# EAGLE schematic hexgame-r1 (EAGLE 5.12)
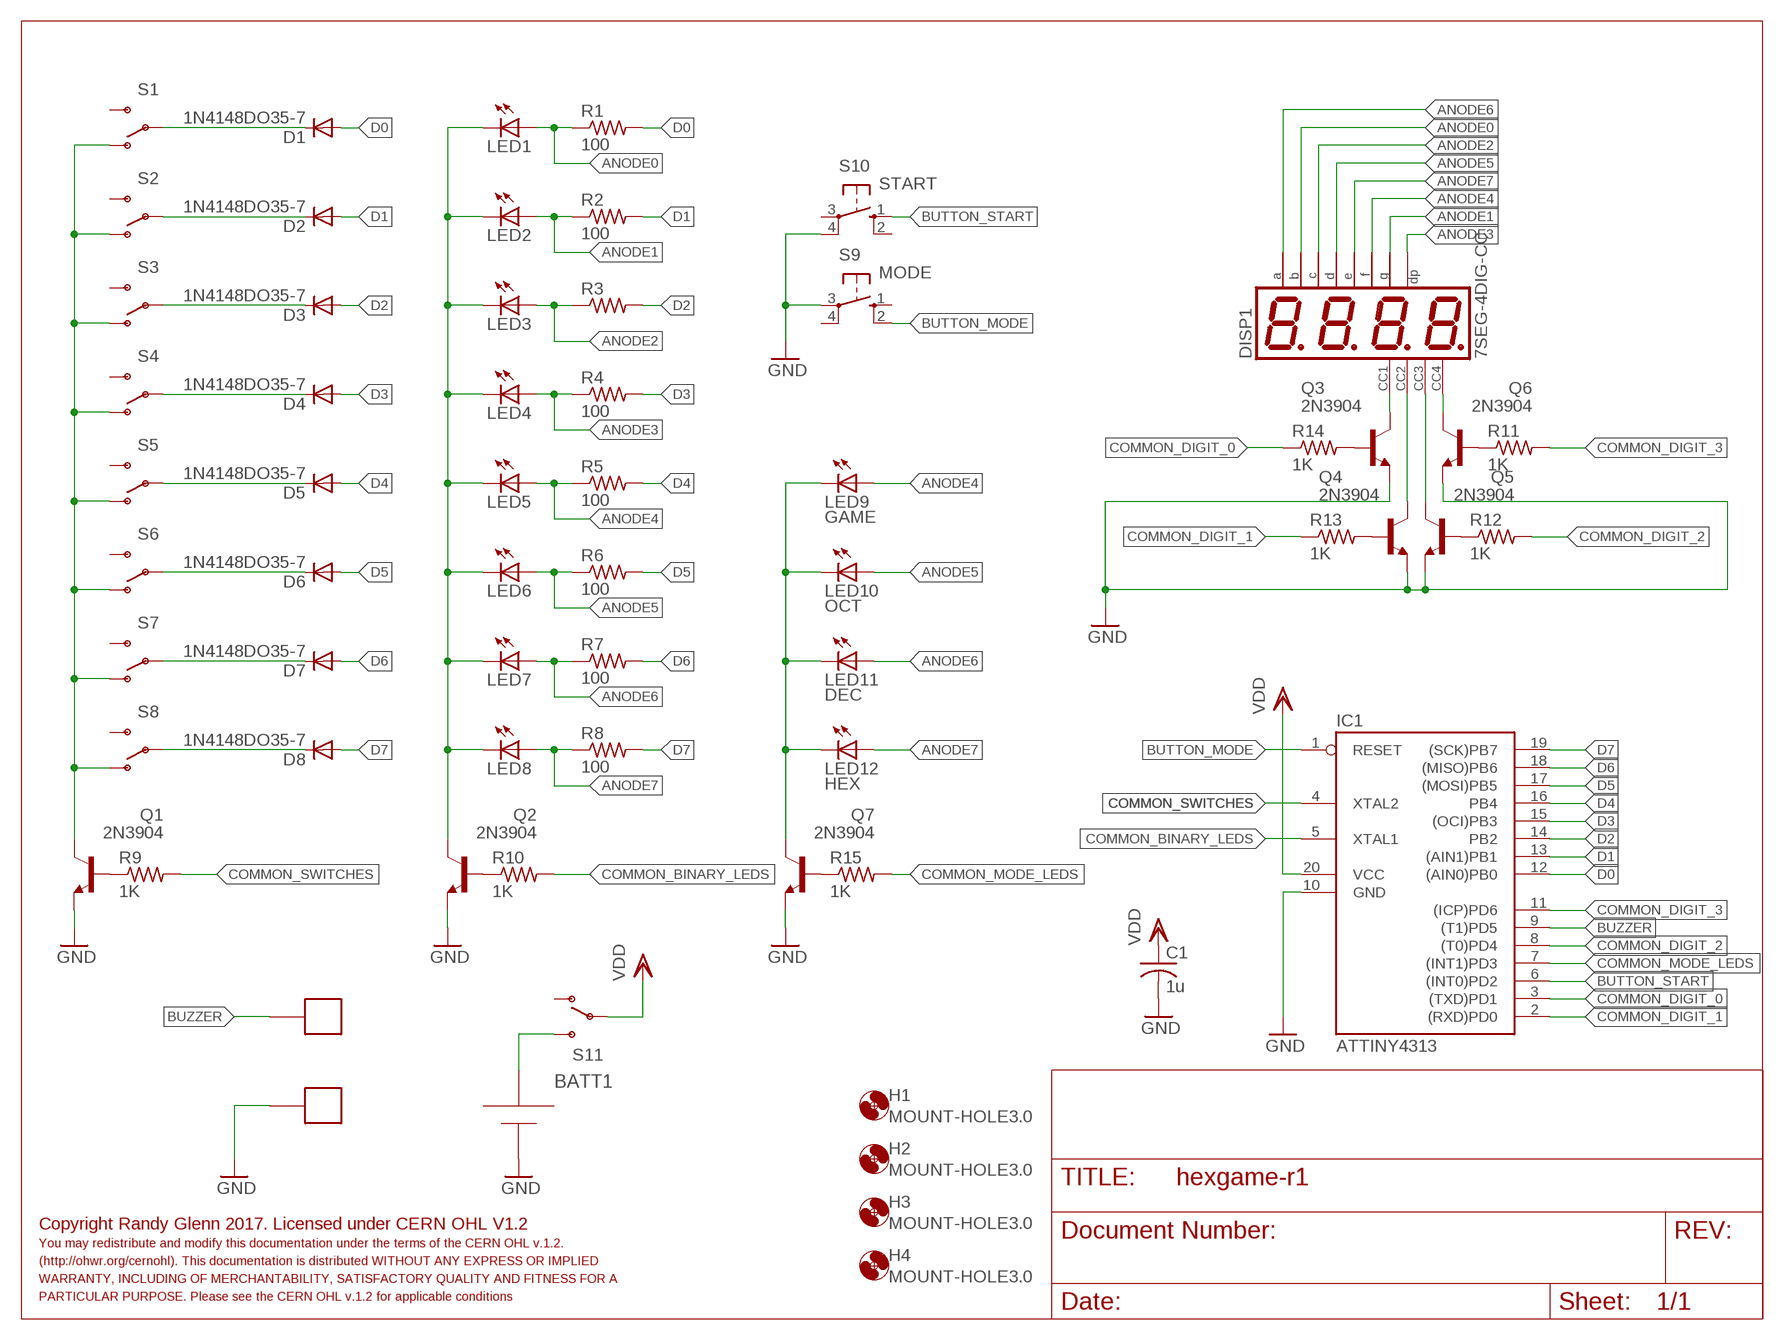
[diagram p0: schematic, sheet 1]

## Parts
BATT1  BC2AAAPC-CHINA  [BC2AAAPC-CHINA]
C1  1u  C-US025-025X050  [C025-025X050]
D1  1N4148DO35-7  [DO35-7]
D2  1N4148DO35-7  [DO35-7]
D3  1N4148DO35-7  [DO35-7]
D4  1N4148DO35-7  [DO35-7]
D5  1N4148DO35-7  [DO35-7]
D6  1N4148DO35-7  [DO35-7]
D7  1N4148DO35-7  [DO35-7]
D8  1N4148DO35-7  [DO35-7]
DISP1  7SEG-4DIG-CC  [7SEG-0.36-4]
H1  MOUNT-HOLE3.0  [3,0]
H2  MOUNT-HOLE3.0  [3,0]
H3  MOUNT-HOLE3.0  [3,0]
H4  MOUNT-HOLE3.0  [3,0]
IC1  ATTINY4313  AT90S2313P  [DIL20]
LED1  LED3MM  [LED3MM]
LED2  LED3MM  [LED3MM]
LED3  LED3MM  [LED3MM]
LED4  LED3MM  [LED3MM]
LED5  LED3MM  [LED3MM]
LED6  LED3MM  [LED3MM]
LED7  LED3MM  [LED3MM]
LED8  LED3MM  [LED3MM]
LED9  GAME  LED3MM  [LED3MM]
LED10  OCT  LED3MM  [LED3MM]
LED11  DEC  LED3MM  [LED3MM]
LED12  HEX  LED3MM  [LED3MM]
Q1  2N3904  [TO92]
Q2  2N3904  [TO92]
Q3  2N3904  [TO92]
Q4  2N3904  [TO92]
Q5  2N3904  [TO92]
Q6  2N3904  [TO92]
Q7  2N3904  [TO92]
R1  100  R-US_0207/10  [0207/10]
R2  100  R-US_0207/10  [0207/10]
R3  R-US_0207/10  [0207/10]
R4  100  R-US_0207/10  [0207/10]
R5  100  R-US_0207/10  [0207/10]
R6  100  R-US_0207/10  [0207/10]
R7  100  R-US_0207/10  [0207/10]
R8  100  R-US_0207/10  [0207/10]
R9  1K  R-US_0207/10  [0207/10]
R10  1K  R-US_0207/10  [0207/10]
R11  1K  R-US_0207/10  [0207/10]
R12  1K  R-US_0207/10  [0207/10]
R13  1K  R-US_0207/10  [0207/10]
R14  1K  R-US_0207/10  [0207/10]
R15  1K  R-US_0207/10  [0207/10]
S1  SWITCH-SPSTPTH  [SWITCH-SPDT]
S2  SWITCH-SPSTPTH  [SWITCH-SPDT]
S3  SWITCH-SPSTPTH  [SWITCH-SPDT]
S4  SWITCH-SPSTPTH  [SWITCH-SPDT]
S5  SWITCH-SPSTPTH  [SWITCH-SPDT]
S6  SWITCH-SPSTPTH  [SWITCH-SPDT]
S7  SWITCH-SPSTPTH  [SWITCH-SPDT]
S8  SWITCH-SPSTPTH  [SWITCH-SPDT]
S9  MODE  10-XX  [B3F-10XX]
S10  START  10-XX  [B3F-10XX]
S11  SWITCH-SPSTPTH  [SWITCH-SPDT]
X1  PAD-2X4  [PAD-2X4]
X2  PAD-2X4  [PAD-2X4]

## Nets
ANODE0: DISP1.7(B) LED1.A R1.1
ANODE1: DISP1.5(G) LED2.A R2.1
ANODE2: DISP1.4(C) LED3.A R3.1
ANODE3: DISP1.3(DP) LED4.A R4.1
ANODE4: DISP1.10(F) LED5.A LED9.A R5.1
ANODE5: DISP1.2(D) LED6.A LED10.A R6.1
ANODE6: DISP1.11(A) LED7.A LED11.A R7.1
ANODE7: DISP1.1(E) LED8.A LED12.A R8.1
BUTTON_MODE: IC1.1(RESET) S9.2(S1)
BUTTON_START: IC1.6((INT0)PD2) S10.1(S)
BUZZER: IC1.9((T1)PD5) X1.P$1
COMMON_BINARY_LEDS: IC1.5(XTAL1) R10.2
COMMON_DIGIT_0: IC1.3((TXD)PD1) R14.1
COMMON_DIGIT_1: IC1.2((RXD)PD0) R13.1
COMMON_DIGIT_2: IC1.8((T0)PD4) R12.2
COMMON_DIGIT_3: IC1.11((ICP)PD6) R11.2
COMMON_MODE_LEDS: IC1.7((INT1)PD3) R15.2
COMMON_SWITCHES: IC1.4(XTAL2) R9.2
D0: D1.A IC1.12((AIN0)PB0) R1.2
D1: D2.A IC1.13((AIN1)PB1) R2.2
D2: D3.A IC1.14(PB2) R3.2
D3: D4.A IC1.15((OCI)PB3) R4.2
D4: D5.A IC1.16(PB4) R5.2
D5: D6.A IC1.17((MOSI)PB5) R6.2
D6: D7.A IC1.18((MISO)PB6) R7.2
D7: D8.A IC1.19((SCK)PB7) R8.2
GND: BATT1.- C1.2 IC1.10(GND) Q1.3(E) Q2.3(E) Q3.3(E) Q4.3(E) Q5.3(E) Q6.3(E) Q7.3(E) S9.3(P) S10.4(P1) X2.P$1
N$1: D1.C S1.2(P)
N$2: D2.C S2.2(P)
N$3: D3.C S3.2(P)
N$4: D4.C S4.2(P)
N$5: D5.C S5.2(P)
N$6: D6.C S6.2(P)
N$7: D7.C S7.2(P)
N$8: D8.C S8.2(P)
N$9: Q1.1(C) S1.1(O) S2.1(O) S3.1(O) S4.1(O) S5.1(O) S6.1(O) S7.1(O) S8.1(O)
N$10: LED1.K(C) LED2.K(C) LED3.K(C) LED4.K(C) LED5.K(C) LED6.K(C) LED7.K(C) LED8.K(C) Q2.1(C)
N$11: DISP1.12(CC1) Q3.1(C)
N$12: DISP1.9(CC2) Q4.1(C)
N$13: DISP1.8(CC3) Q5.1(C)
N$14: DISP1.6(CC4) Q6.1(C)
N$15: Q1.2(B) R9.1
N$16: Q2.2(B) R10.1
N$17: Q6.2(B) R11.1
N$18: Q5.2(B) R12.1
N$19: Q4.2(B) R13.2
N$20: Q3.2(B) R14.2
N$21: Q7.2(B) R15.1
N$22: LED9.K(C) LED10.K(C) LED11.K(C) LED12.K(C) Q7.1(C)
N$23: BATT1.+ S11.3(S)
VDD: C1.1 IC1.20(VCC) S11.2(P)
Unconnected: S1.3(S) S2.3(S) S3.3(S) S4.3(S) S5.3(S) S6.3(S) S7.3(S) S8.3(S) S9.1(S) S9.4(P1) S10.2(S1) S10.3(P) S11.1(O)

## Notes on the sheet
- Copyright Randy Glenn 2017. Licensed under CERN OHL V1.2
- You may redistribute and modify this documentation under the terms of the CERN OHL v.1.2.
- (http://ohwr.org/cernohl). This documentation is distributed WITHOUT ANY EXPRESS OR IMPLIED
- WARRANTY, INCLUDING OF MERCHANTABILITY, SATISFACTORY QUALITY AND FITNESS FOR A
- PARTICULAR PURPOSE. Please see the CERN OHL v.1.2 for applicable conditions

## Library data of the parts
BATT1 = rbg-mpd-battholder:BC2AAAPC-CHINA
C1 = rcl:C-US: CAPACITOR, American symbol
D1-D8 = diode:1N4148: DIODE high speed (Philips)
DISP1 = led-display-4digit:7SEG-4DIG-CC
H1-H4 = holes:MOUNT-HOLE: MOUNTING HOLE with drill center marker
IC1 = atmel-1:AT90S2313: MICROCONTROLLER 2 Kbytes FLASH 128 bytes SRAM 128 bytes EEPROM UART
LED1-LED12 = led:LED: LED OSRAM: - CHIPLED LG R971, LG N971, LY N971, LG Q971, LY Q971, LO R971, LY R971 LH N974, LH R974 LS Q976, LO Q976, LY Q976 LO Q996 - Hyper CHIPLED LW Q18S LB Q993, LB Q99A, LB R99A - SideLED LS A670, LO A670, LY A670, LG A670, LP A670 LB A673, LV A673, LT A673, LW A673 LH A674 LY A675 LS A676, LA A676, LO A676, LY A676, LW A676 LS A679, LY A679, LG A679 - Hyper Micro SIDELED® LS Y876, LA Y876, LO Y876, LY Y876 LT Y87S - SmartLED LW L88C, LW L88S LB L89C, LB L89S, LG L890 LS L89K, LO L89K, LY L89K LS L896, LA L896, LO L896, LY L896 - TOPLED LS T670, LO T670, LY T670, LG T670, LP T670 LSG T670, LSP T670, LSY T670, LOP T670, LYG T670 LG T671, LOG T671, LSG T671 LB T673, LV T673, LT T673, LW T673 LH T674 LS T676, LA T676, LO T676, LY T676, LB T676, LH T676, LSB T676, LW T676 LB T67C, LV T67C, LT T67C, LS T67K, LO T67K, LY T67K, LW E67C LS E67B, LA E67B, LO E67B, LY E67B, LB E67C, LV E67C, LT E67C LW T67C LS T679, LY T679, LG T679 LS T770, LO T770, LY T770, LG T770, LP T770 LB T773, LV T773, LT T773, LW T773 LH T774 LS E675, LA E675, LY E675, LS T675 LS T776, LA T776, LO T776, LY T776, LB T776 LHGB T686 LT T68C, LB T68C - Hyper Mini TOPLED® LB M676 - Mini TOPLED Santana® LG M470 LS M47K, LO M47K, LY M47K Source: http://www.osram.convergy.de LUXEON: - LUMILED® LXK2-PW12-R00, LXK2-PW12-S00, LXK2-PW14-U00, LXK2-PW14-V00 LXK2-PM12-R00, LXK2-PM12-S00, LXK2-PM14-U00 LXK2-PE12-Q00, LXK2-PE12-R00, LXK2-PE12-S00, LXK2-PE14-T00, LXK2-PE14-U00 LXK2-PB12-K00, LXK2-PB12-L00, LXK2-PB12-M00, LXK2-PB14-N00, LXK2-PB14-P00, LXK2-PB14-Q00 LXK2-PR12-L00, LXK2-PR12-M00, LXK2-PR14-Q00, LXK2-PR14-R00 LXK2-PD12-Q00, LXK2-PD12-R00, LXK2-PD12-S00 LXK2-PH12-R00, LXK2-PH12-S00 LXK2-PL12-P00, LXK2-PL12-Q00, LXK2-PL12-R00 Source: www.luxeon.com KINGBRIGHT: KA-3528ASYC Source: www.kingbright.com
Q1-Q7 = transistor-npn:2N3904: NPN Transistor
R1-R15 = rcl:R-US_: RESISTOR, American symbol
S1-S8 S11 = SparkFun:SWITCH-SPST: SPST Switch Simple slide switch. Spark Fun Electronics SKU : COM-00102
S9 S10 = rbg-generic-tact-switch:10-XX: OMRON SWITCH
X1 X2 = rbg-generic-pads:PAD